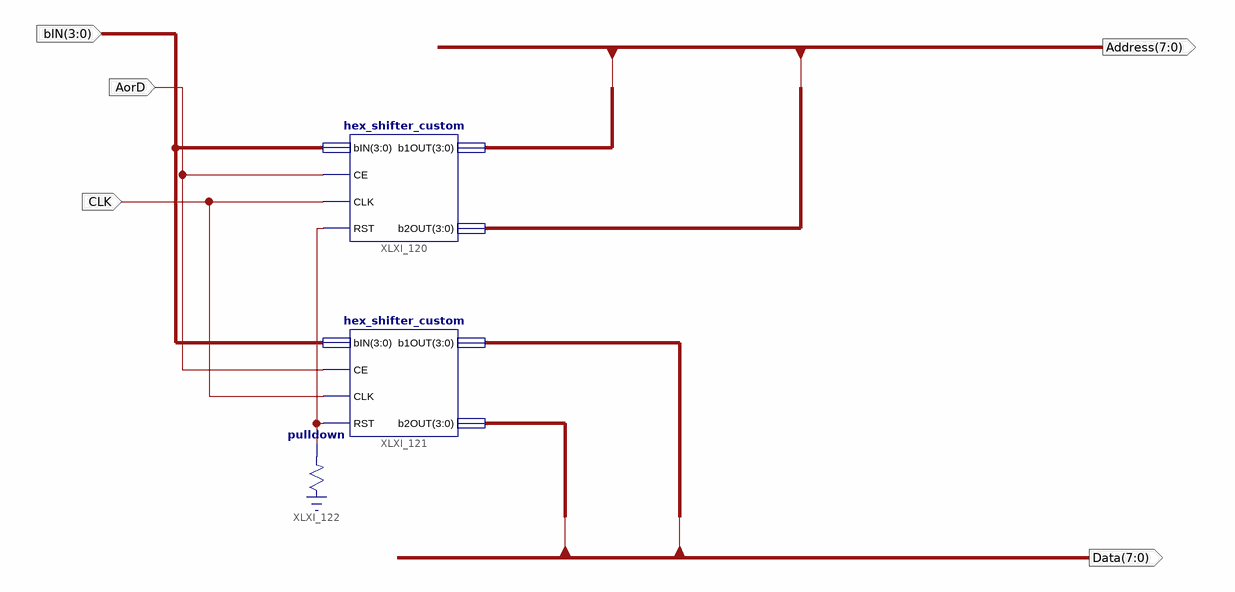
[diagram p0: schematic sheet 1]
// Xilinx ISE schematic keypad_shift.sch (spartan3e) as structural Verilog: 3 symbols, 5 ports
module keypad_shift (
  input  AorD,
  input  CLK,
  input  [3:0] bIN,
  output [7:0] Address,
  output [7:0] Data
);

  wire XLXN_283;

  hex_shifter_custom XLXI_120 (
    .bIN(bIN), .CE(AorD), .CLK(CLK), .RST(XLXN_283), .b1OUT(Address[3:0]), .b2OUT(Address[7:4]));
  hex_shifter_custom XLXI_121 (.bIN(bIN), .CE(AorD), .CLK(CLK), .RST(XLXN_283), .b1OUT(Data[3:0]), .b2OUT(Data[7:4]));
  \pulldown  XLXI_122 (.O(XLXN_283));
endmodule
